# EAGLE schematic Analog Switch (EAGLE 6.6.0)
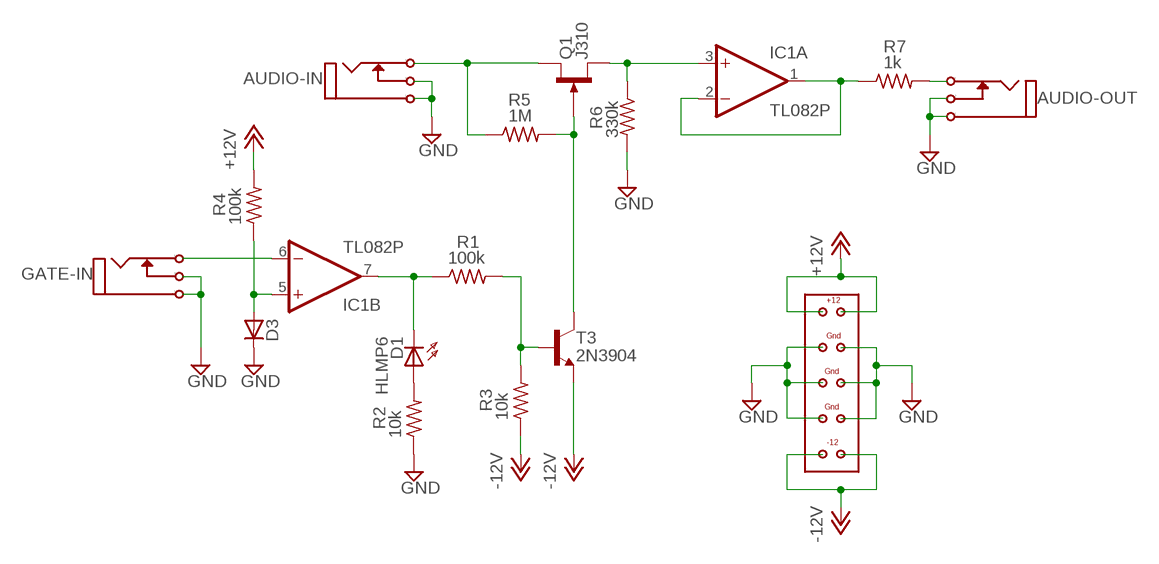
[diagram p0: schematic, sheet 1]

## Parts
AUDIO-IN  I/O  MONO_JACK  [MONO_JACK]
AUDIO-OUT  I/O  MONO_JACK  [MONO_JACK]
D1  HLMP6  [HLMP6]
D3  1N4004  [DO41-10]
GATE-IN  I/O  MONO_JACK  [MONO_JACK]
IC1  TL082P  [DIL08]
Q1  J310  [TO92R]
R1  100k  R-US_0204/2V  [0204V]
R2  10k  R-US_0204/2V  [0204V]
R3  10k  R-US_0204/2V  [0204V]
R4  100k  R-US_0204/2V  [0204V]
R5  1M  R-US_0204/2V  [0204V]
R6  330k  R-US_0204/2V  [0204V]
R7  1k  R-US_0204/2V  [0204V]
T3  2N3904  [TO92]
U$1  EURORACK-POWER  [EURORACK-POWER]

## Nets
+12V: R4.2 U$1.P$1 U$1.P$2
-12V: R3.1 T3.3(E) U$1.P$9 U$1.P$10
GND: AUDIO-IN.P$1 AUDIO-IN.P$3(P3) AUDIO-OUT.P$1 AUDIO-OUT.P$3(P3) D3.C GATE-IN.P$1 GATE-IN.P$3(P3) R2.1 R6.2 U$1.P$3 U$1.P$4 U$1.P$5 U$1.P$6 U$1.P$7 U$1.P$8
N$1: AUDIO-IN.P$2(P2) Q1.D R5.1
N$2: D1.K IC1.7(B:OUT) R1.1
N$3: Q1.G R5.2 T3.1(C)
N$4: GATE-IN.P$2(P2) IC1.6(B:-IN)
N$5: D1.A R2.2
N$6: R1.2 R3.2 T3.2(B)
N$7: D3.A IC1.5(B:+IN) R4.1
N$9: Q1.S R6.1
N$10: IC1.1(A:OUT) IC1.2(A:-IN) R7.1
N$11: AUDIO-OUT.P$2(P2) R7.2
Unconnected: IC1.3(A:+IN)

## Power pins joined to a net without a drawn wire
V+: IC1.8(P:V+)
V-: IC1.4(P:V-)

## Library data of the parts
AUDIO-IN AUDIO-OUT GATE-IN = !synth_sch:MONO_JACK
D1 = display-hp:HLMP6: LED 2mm horizontal; MF: AGILENT TECHNOLOGIES; MPN: HLMP-6500; OC_FARNELL: 1652490; OC_NEWARK: 40K0088
D3 = diode:1N4004: DIODE general purpose rectifier, 1 A
IC1 = linear:TL082: OP AMP Data sheet <http://www.ti.com/lit/ds/symlink/tl084a . pdf>; DATA_SHEET: <a href="http://www.ti.com/lit/ds/symlink/tl084a.pdf"> Data sheet </a>
Q1 = transistor-small-signal:J310: N-Channel RF Amplifier J309, J310 Source: http://www.fairchildsemi.com/pf/J3/J310.html
R1-R7 = resistor:R-US_: RESISTOR, American symbol
T3 = transistor:2N3904: NPN TRANSISTOR
U$1 = !synth_sch:EURORACK-POWER